# Altium project AuxMe.PrjPcb
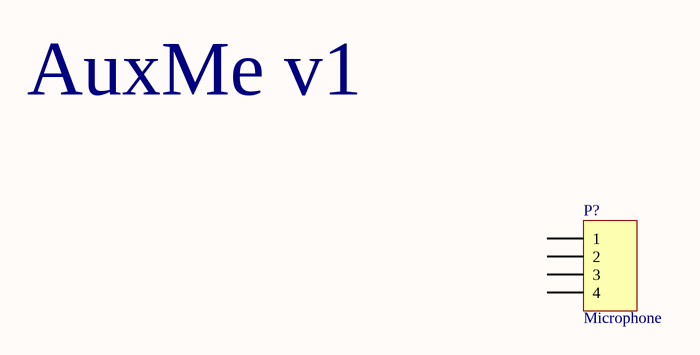
[diagram p0: AuxMe_v1.SchDoc]
1 sheet, 1 parts. Net scope: global (net labels, ports and power ports of the same name join across sheets).
Board file: AuxMe_v1.PcbDoc

## Sheet AuxMe_v1.SchDoc
size A4 portrait; Organization: Altium Limited; Address1: L3, 12a Rodborough Rd; Address2: Frenchs Forest; Address3: NSW; Address4: Australia 2086

### Parts
P?  Microphone  [HDR1X4]

### Nets

Not connected (* = marked no-connect by the designer): P? 1 2 3 4

### Notes on the sheet
- AuxMe v1
- Title
- Size:
- Date:
- A4
- Number:
- Time:
- Revision:
- Sheet
- of
- File:

### Library data of the parts
P? = Header 4: Header, 4-Pin; LatestRevisionDate: 17-Jul-2002; LatestRevisionNote: Re-released for DXP Platform.; Publisher: Altium Limited